# Altium schematic sheet trigger_interface.SchDoc
size A4; SheetNumber: 6; SheetTotal: 8
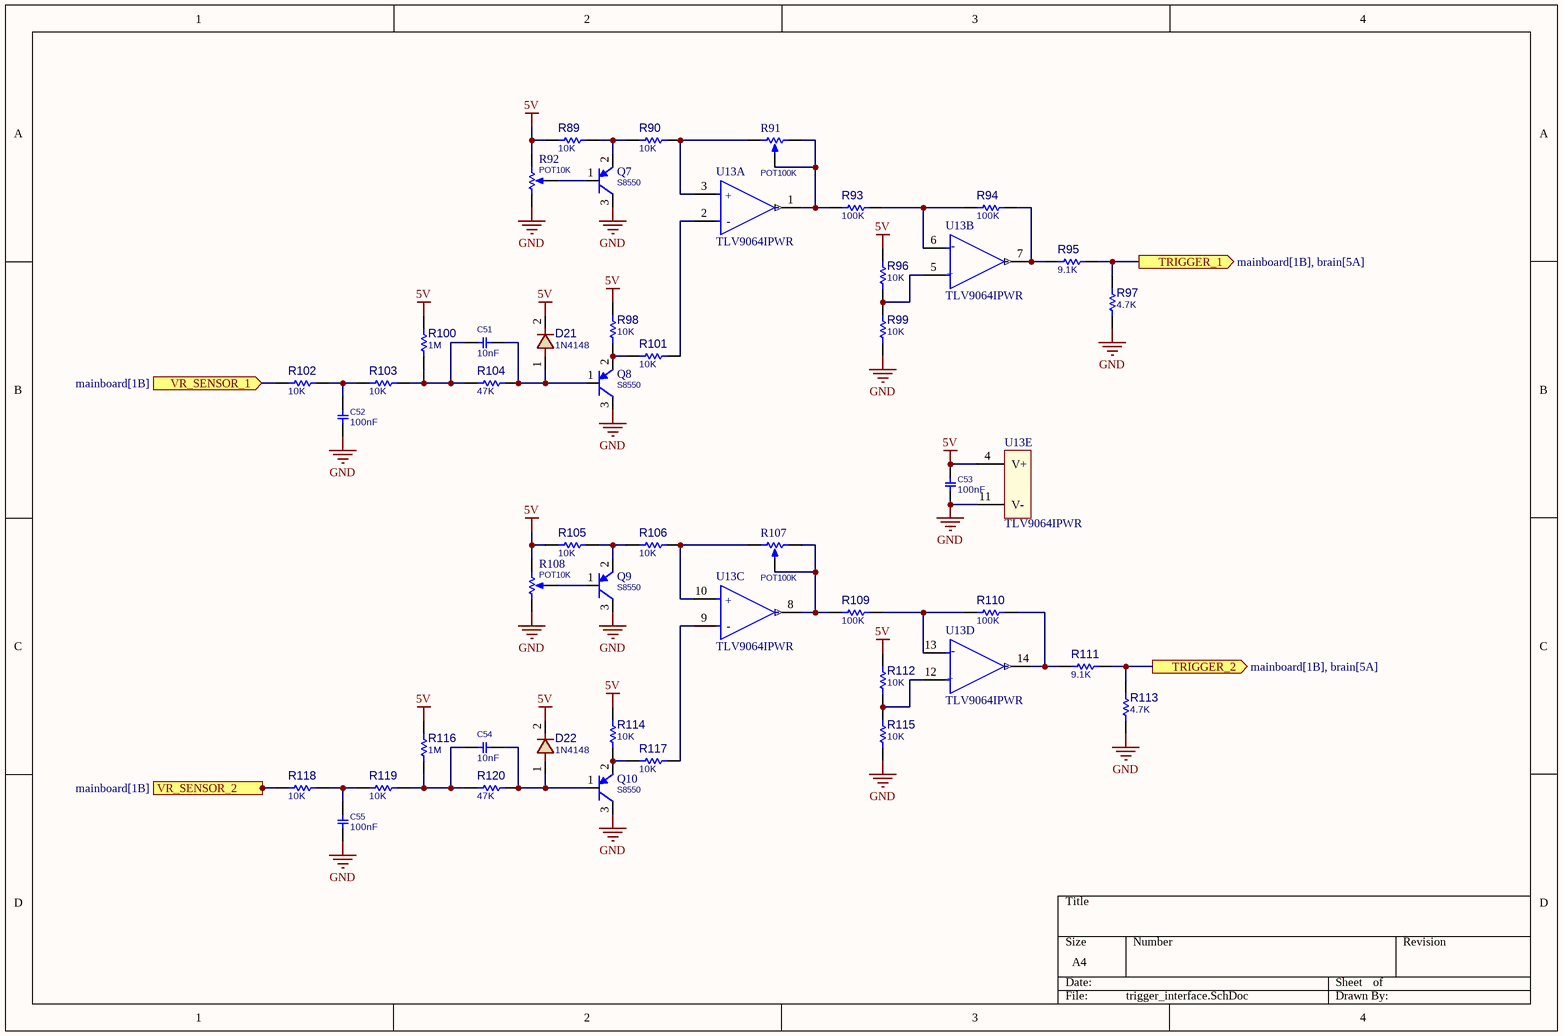
[diagram p0: trigger_interface.SchDoc]

## Parts
C51  10nF  [C0805]
C52  100nF  [C0805]
C53  100nF  [C0805]
C54  10nF  [C0805]
C55  100nF  [C0805]
D21  1N4148  [D_SOD80]
D22  1N4148  [D_SOD80]
Q7  S8550  [SOT23_3]
Q8  S8550  [SOT23_3]
Q9  S8550  [SOT23_3]
Q10  S8550  [SOT23_3]
R89  10K  [R0805]
R90  10K  [R0805]
R91  POT100K  [POT_7X5]
R92  POT10K  [POT_7X5]
R93  100K  [R0805]
R94  100K  [R0805]
R95  9.1K  [R0805]
R96  10K  [R0805]
R97  4.7K  [R0805]
R98  10K  [R0805]
R99  10K  [R0805]
R100  1M  [R0805]
R101  10K  [R0805]
R102  10K  [R0805]
R103  10K  [R0805]
R104  47K  [R0805]
R105  10K  [R0805]
R106  10K  [R0805]
R107  POT100K  [POT_7X5]
R108  POT10K  [POT_7X5]
R109  100K  [R0805]
R110  100K  [R0805]
R111  9.1K  [R0805]
R112  10K  [R0805]
R113  4.7K  [R0805]
R114  10K  [R0805]
R115  10K  [R0805]
R116  1M  [R0805]
R117  10K  [R0805]
R118  10K  [R0805]
R119  10K  [R0805]
R120  47K  [R0805]
U13  TLV9064IPWR  [TTSOP-14]  (parts A,B,C,D,E of 5)

## Ports
TRIGGER_1 (out, see mainboard[1B], brain[5A]), TRIGGER_2 (out, see mainboard[1B], brain[5A]), VR_SENSOR_1 (in, see mainboard[1B]), VR_SENSOR_2 (in, see mainboard[1B])

## Nets
5V: C53.2 D21.2 D22.2 R89.1 R92.3(BOT) R96.2 R98.1 R100.1 R105.1 R108.3(BOT) R112.2 R114.1 R116.1 U13.4(V+)
GND: C52.1 C53.1 C55.1 Q7.3(C) Q8.3(C) Q9.3(C) Q10.3(C) R92.1(TOP) R97.1 R99.2 R108.1(TOP) R113.1 R115.2 U13.11(V-)
TRIGGER_1: R95.2 R97.2 ; port TRIGGER_1
TRIGGER_2: R111.2 R113.2 ; port TRIGGER_2
VR_SENSOR_1: R102.2 ; port VR_SENSOR_1
VR_SENSOR_2: R118.2 ; port VR_SENSOR_2
NetC51_1: C51.1 D21.1 Q8.1(B) R104.1
NetC51_2: C51.2 R100.2 R103.1 R104.2
NetC52_2: C52.2 R102.1 R103.2
NetC54_1: C54.1 D22.1 Q10.1(B) R120.1
NetC54_2: C54.2 R116.2 R119.1 R120.2
NetC55_2: C55.2 R118.1 R119.2
NetQ7_1: Q7.1(B) R92.2(TAP)
NetQ7_2: Q7.2(E) R89.2 R90.1
NetQ8_2: Q8.2(E) R98.2 R101.1
NetQ9_1: Q9.1(B) R108.2(TAP)
NetQ9_2: Q9.2(E) R105.2 R106.1
NetQ10_2: Q10.2(E) R114.2 R117.1
NetR90_2: R90.2 R91.1(TOP) U13.3(IN1+)
NetR91_2: R91.2(TAP) R91.3(BOT) R93.1 U13.1(OUT1)
NetR93_2: R93.2 R94.1 U13.6(IN2-)
NetR94_2: R94.2 R95.1 U13.7(OUT2)
NetR96_1: R96.1 R99.1 U13.5(IN2+)
NetR101_2: R101.2 U13.2(IN1-)
NetR106_2: R106.2 R107.1(TOP) U13.10(IN3+)
NetR107_2: R107.2(TAP) R107.3(BOT) R109.1 U13.8(OUT3)
NetR109_2: R109.2 R110.1 U13.13(IN4-)
NetR110_2: R110.2 R111.1 U13.14(OUT4)
NetR112_1: R112.1 R115.1 U13.12(IN4+)
NetR117_2: R117.2 U13.9(IN3-)

## Notes on the sheet
- (in symbol TLV9064, part A) +; -
- (in symbol TLV9064, part B) -; +
- (in symbol TLV9064, part C) +; -
- (in symbol TLV9064, part D) -; +

## Library data of the parts
C51-C55 = CAP_SMD_MLCC: CAP, MLCC; PARAM: C0G, 10%; DESC: CAP, MLCC, 1nF, 50V, C0G, 10%, 0402; MANF_P#: MANF_PART#; MANF: Murata; PARAM2: 50V; PRICE: 100= 1$; ASSEMBLY: ASSEMBLY
  C51 C54: VALUE: 10nF
  C52 C53 C55: VALUE: 100nF
D21 D22 = DIODE_SMD_1N4148_SOD80: DIODE, FAST SWTICHING, 0.3A, 0.5W; DESC: DESCRIPTION; PARAM: 75V; PARAM2: 300mA, 0.5W; MANF: MANF; ASSEMBLY: ASSEMBLY; PRICE: PRICE; MANF_P#: 1N4148; VALUE: 1N4148
Q7-Q10 = PNP_S8550_SOT23: BJT, PNP, 25v, 0.5A, SMD, SOT23; PARAM2: 300mW; PARAM: 25v, 0.5A; MANF_P#: S8550; MANF: -; VALUE: S8550
R89 R90 R93-R106 R109-R120 = RES_SMD: RESISTOR, SMD; PARAM: -W; DESC: DESCRIPTION; DIST#: MOUSER; PARAM2: 1%; MANF_P#: -; MANF: -; ASSEMBLY: ASSEMBLY; PRICE: 100= 0.5$
  R89 R90 R96 R98 R99 R101-R103 R105 R106 R112 R114 R115 R117-R119: VALUE: 10K
  R93 R94 R109 R110: VALUE: 100K
  R95 R111: VALUE: 9.1K
  R97 R113: VALUE: 4.7K
  R100 R116: VALUE: 1M
  R104 R120: VALUE: 47K
R91 R92 R107 R108 = RES_THD_POT_7X5: RESISTOR, THD, Potentiometer
  R91 R107: VALUE: POT100K
  R92 R108: VALUE: POT10K
U13 = TLV9064: IC CMOS 4 CIRCUIT 14TSSOP; Output Current per Channel: 50mA; Gain Bandwidth Product: 10MHz; Operating Supply Current: 538uA; Input Bias Current: 0.5pA; Input Offset Voltage (Vos): 300uV; Number of Channels: 4; Slew Rate: 6.5V/µs; Mount: Surface Mount; Min Operating Temperature: -40°C; Case/Package: TSSOP; RoHS Compliant: Yes; Packaging: Tape and Reel; Number of Pins: 14; Number of Circuits: 4; Max Operating Temperature: 125°C